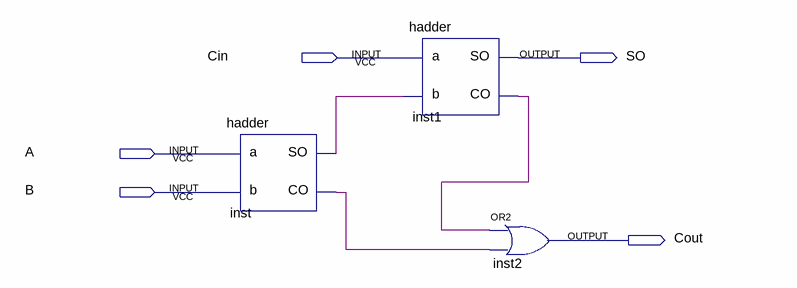
[diagram p0: schematic sheet]
// Quartus schematic lab202.bdf as structural Verilog: 3 symbols, 5 pins
module lab202 (
  input  Cin,
  input  A,
  input  B,
  output SO,
  output Cout
);

  wire inst1_co, inst_co, inst_so;

  hadder inst (.a(A), .b(B), .CO(inst_co), .SO(inst_so));
  hadder inst1 (.a(Cin), .b(inst_so), .CO(inst1_co), .SO(SO));
  or inst2 (Cout, inst1_co, inst_co);
endmodule
